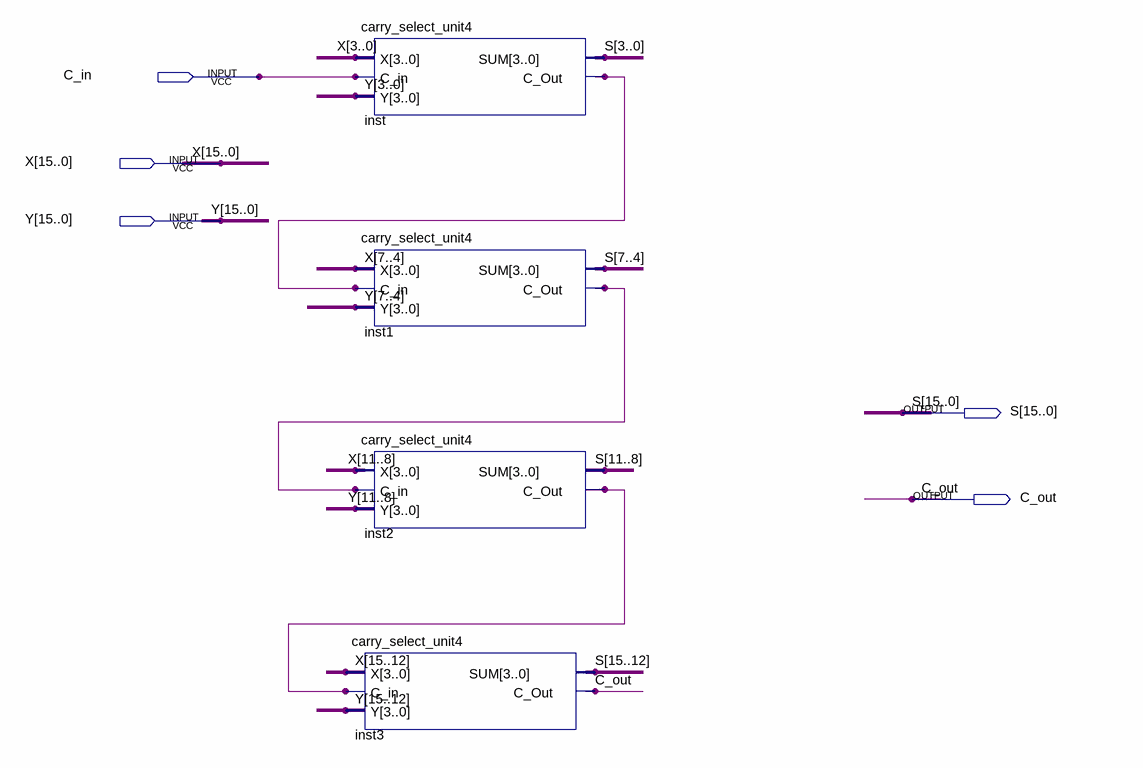
[diagram p0: schematic sheet]
// Quartus schematic carr_select_16_using4.bdf as structural Verilog: 4 symbols, 5 pins
module carr_select_16_using4 (
  input  C_in,
  input  [15:0] X,
  input  [15:0] Y,
  output [15:0] S,
  output C_out
);

  wire inst1_c_out, inst2_c_out, inst_c_out;

  carry_select_unit4 inst3 (.X(X[15:12]), .C_in(inst2_c_out), .Y(Y[15:12]), .SUM(S[15:12]), .C_Out(C_out));
  carry_select_unit4 inst (.X(X[3:0]), .C_in(C_in), .Y(Y[3:0]), .SUM(S[3:0]), .C_Out(inst_c_out));
  carry_select_unit4 inst1 (.X(X[7:4]), .C_in(inst_c_out), .Y(Y[7:4]), .SUM(S[7:4]), .C_Out(inst1_c_out));
  carry_select_unit4 inst2 (.X(X[11:8]), .C_in(inst1_c_out), .Y(Y[11:8]), .SUM(S[11:8]), .C_Out(inst2_c_out));
endmodule
